# EAGLE design 328p_DIP_Galv_009_gnd (EAGLE 7.1.0)
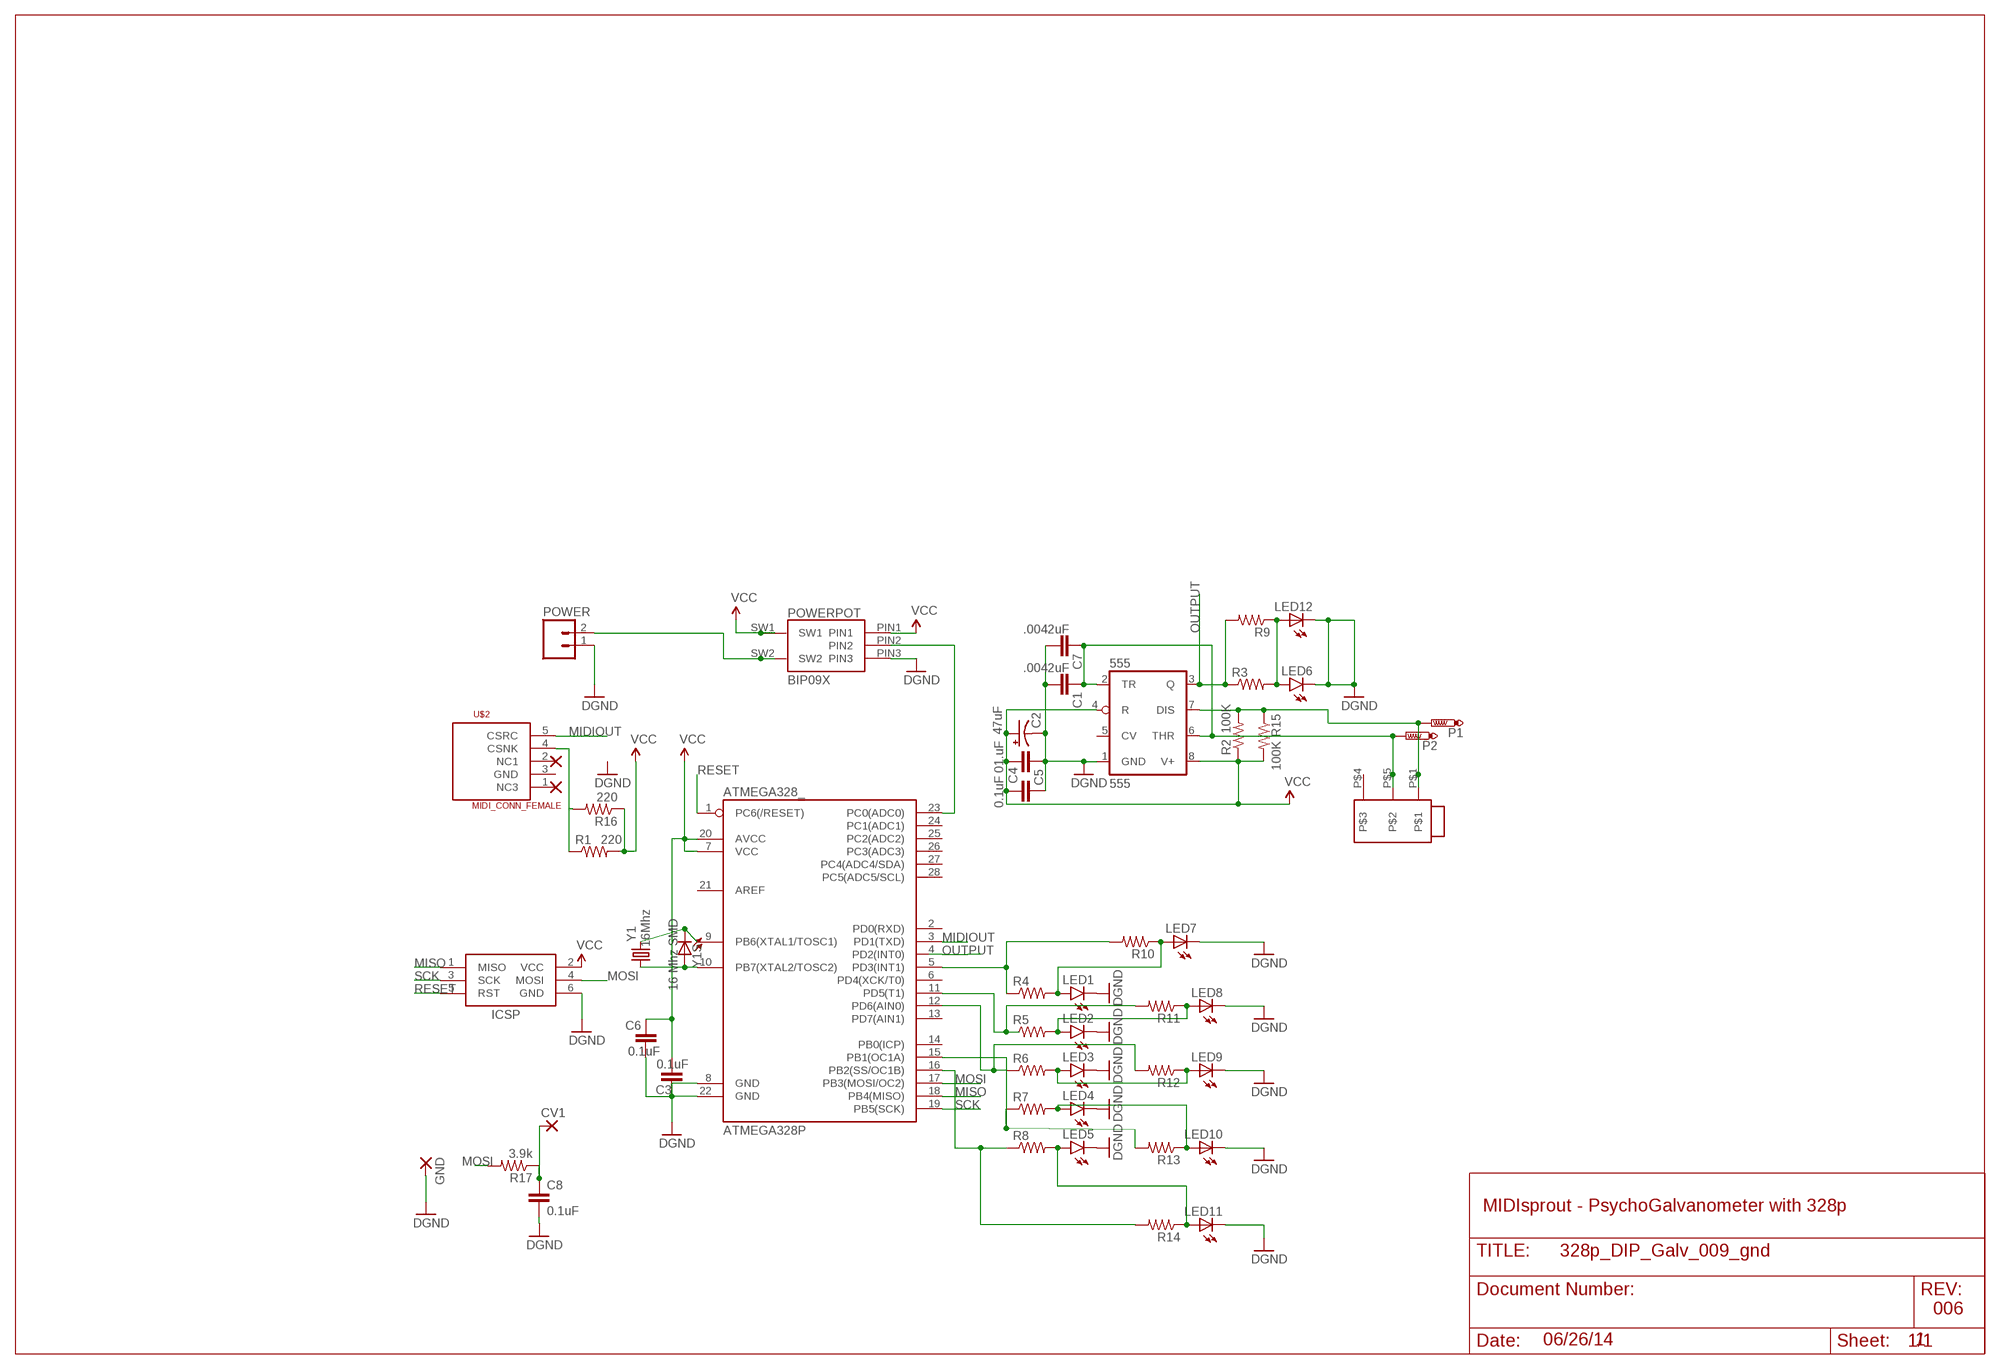
[diagram p0: schematic, sheet 1]

## Parts
555  555  LM555N  [DIL08-ROUND]
ATMEGA328_  ATMEGA328P  ATMEGA328P_PDIP  [DIL28-3]
C1  .0042uF  CAPPTH  [CAP-PTH-SMALL]
C2  47uF  CAP_POLPTH2  [CPOL-RADIAL-10UF-25V]
C3  0.1uF  CAPPTH  [CAP-PTH-SMALL]
C4  0.1uF  CAPPTH  [CAP-PTH-SMALL]
C5  01.uF  CAP1206  [1206]
C6  0.1uF  CAP1206  [1206]
C7  .0042uF  CAP1206  [1206]
C8  0.1uF  CAP1206  [1206]
CV1  2,54/1,1  [2,54/1,1]
GND  2,54/1,1  [2,54/1,1]
ICSP  AVRISP-6  [AVRISP]
LED1  LED5MM  [LED5MM]
LED2  LED5MM  [LED5MM]
LED3  LED5MM  [LED5MM]
LED4  LED5MM  [LED5MM]
LED5  LED5MM  [LED5MM]
LED6  LED5MM  [LED5MM]
LED7  LEDSML1206  [SML1206]
LED8  LEDSML1206  [SML1206]
LED9  LEDSML1206  [SML1206]
LED10  LEDSML1206  [SML1206]
LED11  LEDSML1206  [SML1206]
LED12  LEDSML1206  [SML1206]
P1  PTR1PAD1-20Y  [P1-20Y]
P2  PTR1PAD1-20Y  [P1-20Y]
POWER  M02LOCK_LONGPADS  [1X02_LOCK_LONGPADS]
POWERPOT  BIP09X  [BIP09X]
R1  220  RESISTORAXIAL-0.3  [AXIAL-0.3]
R2  100K  RESISTORAXIAL-0.3  [AXIAL-0.3]
R3  RESISTORAXIAL-0.3  [AXIAL-0.3]
R4  RESISTORAXIAL-0.3  [AXIAL-0.3]
R5  RESISTORAXIAL-0.3  [AXIAL-0.3]
R6  RESISTORAXIAL-0.3  [AXIAL-0.3]
R7  RESISTORAXIAL-0.3  [AXIAL-0.3]
R8  RESISTORAXIAL-0.3  [AXIAL-0.3]
R9  R-US_R1206  [R1206]
R10  R-US_R1206  [R1206]
R11  R-US_R1206  [R1206]
R12  R-US_R1206  [R1206]
R13  R-US_R1206  [R1206]
R14  R-US_R1206  [R1206]
R15  100K  R-US_R1206  [R1206]
R16  220  R-US_R1206  [R1206]
R17  3.9k  R-US_R1206  [R1206]
U$1  MONOJACK  [MONOJACK_SWCR_3.5]
U$2  MIDI_CONN_FEMALE  [DIN_5_FEMALE]
Y1  16Mhz  CRYSTALHC49US  [HC49US]
Y1S  16 Mhz SMD  LEDSML1206  [SML1206]

## Nets
GND: 555.1(GND) ATMEGA328_.8(GND) ATMEGA328_.22(GND) C1.2 C2.2(-) C3.1 C4.2 C5.1 C6.2 C7.2 C8.2 GND.1(P) ICSP.6(GND) LED1.K(C) LED2.K(C) LED3.K(C) LED4.K(C) LED5.K(C) LED6.K(C) LED7.C LED8.C LED9.C LED10.C LED11.C LED12.C POWER.1 POWERPOT.PIN3 ; supply symbol labelled DGND
MIDIOUT: ATMEGA328_.3(PD1(TXD)) U$2.5(CSRC)
MISO: ATMEGA328_.18(PB4(MISO)) ICSP.1(MISO)
MOSI: ATMEGA328_.17(PB3(MOSI/OC2)) ICSP.4(MOSI) R17.2
N$1: C8.1 CV1.1(P) R17.1
N$2: ATMEGA328_.10(PB7(XTAL2/TOSC2)) Y1.1 Y1S.A
N$3: ATMEGA328_.9(PB6(XTAL1/TOSC1)) Y1.2 Y1S.C
N$7: ATMEGA328_.23(PC0(ADC0)) POWERPOT.PIN2
N$9: R1.P$1 R16.2 U$2.4(CSNK)
N$10: ATMEGA328_.5(PD3(INT1)) R4.P$1 R10.2
N$11: ATMEGA328_.11(PD5(T1)) R5.P$1 R11.2
N$12: ATMEGA328_.12(PD6(AIN0)) R6.P$1 R12.2
N$13: POWER.2 POWERPOT.SW2
N$14: ATMEGA328_.15(PB1(OC1A)) R7.P$1 R13.2
N$15: ATMEGA328_.16(PB2(SS/OC1B)) R8.P$1 R14.2
N$16: LED1.A LED7.A R4.P$2 R10.1
N$18: LED2.A LED8.A R5.P$2 R11.1
N$19: LED3.A LED9.A R6.P$2 R12.1
N$20: LED4.A LED10.A R7.P$2 R13.1
N$21: LED5.A LED11.A R8.P$2 R14.1
N$26: LED6.A LED12.A R3.P$2 R9.1
OUTPUT: 555.3(Q) ATMEGA328_.4(PD2(INT0)) R3.P$1 R9.2
PROBE1: 555.2(TR) 555.6(THR) C1.1 C7.1 P2.TP U$1.P$5
PROBE2: 555.7(DIS) P1.TP R2.P$2 R15.1 U$1.P$1
RESET: ATMEGA328_.1(PC6(/RESET)) ICSP.5(RST)
SCK: ATMEGA328_.19(PB5(SCK)) ICSP.3(SCK)
VCC: 555.4(R) 555.8(V+) ATMEGA328_.7(VCC) ATMEGA328_.20(AVCC) C2.1(+) C3.2 C4.1 C5.2 C6.1 ICSP.2(VCC) POWERPOT.PIN1 POWERPOT.SW1 R1.P$2 R2.P$1 R15.2 R16.1
Unconnected: 555.5(CV) ATMEGA328_.2(PD0(RXD)) ATMEGA328_.6(PD4(XCK/T0)) ATMEGA328_.13(PD7(AIN1)) ATMEGA328_.14(PB0(ICP)) ATMEGA328_.21(AREF) ATMEGA328_.24(PC1(ADC1)) ATMEGA328_.25(PC2(ADC2)) ATMEGA328_.26(PC3(ADC3)) ATMEGA328_.27(PC4(ADC4/SDA)) ATMEGA328_.28(PC5(ADC5/SCL)) U$1.P$4 U$2.1(NC3) U$2.2(NC1) U$2.3(GND)

## Notes on the sheet
- MIDIsprout - PsychoGalvanometer with 328p
- 006
- 06/26/14 | 1

## Library data of the parts
555 = adafruit:*555: TIMER Changed DIP package to have round (not oval) pin pads http://www.ladyada.net/library/pcb/eaglelibrary.html
ATMEGA328_ = SparkFun-DigitalIC:ATMEGA328P_PDIP: uC used in the Arduino 32kb flash, 1k EEPROM, 2k SRAM This is the through-hole version of this chip.
C1 C5-C8 = SparkFun-Passives:CAP: Capacitor Standard 0603 ceramic capacitor, and 0.1" leaded capacitor.
C2 = SparkFun-Passives:CAP_POL: Capacitor Polarized These are standard SMD and PTH capacitors. Normally 10uF, 47uF, and 100uF in electrolytic and tantalum varieties. Always verify the external diameter of the through hole cap, it varies with capacity, voltage, and manufacturer. The EIA devices should be standard.
C3 C4 = SparkFun-Capacitors:CAP: Capacitor Standard 0603 ceramic capacitor, and 0.1" leaded capacitor.
CV1 GND = wirepad:2,54/1,1: THROUGH-HOLE PAD
ICSP = adafruit:AVRISP: AVR ISP HEADER Standard 6 pin header for AVR programming
LED1-LED6 = SparkFun-LED:LED: LEDs Standard schematic elements and footprints for 5mm, 3mm, 1206, and 0603 sized LEDs. 5mm - Spark Fun Electronics SKU : COM-00529 (and others)
LED7-LED12 Y1S = led:LED: LED OSRAM: - CHIPLED LG R971, LG N971, LY N971, LG Q971, LY Q971, LO R971, LY R971 LH N974, LH R974 LS Q976, LO Q976, LY Q976 LO Q996 - Hyper CHIPLED LW Q18S LB Q993, LB Q99A, LB R99A - SideLED LS A670, LO A670, LY A670, LG A670, LP A670 LB A673, LV A673, LT A673, LW A673 LH A674 LY A675 LS A676, LA A676, LO A676, LY A676, LW A676 LS A679, LY A679, LG A679 - Hyper Micro SIDELED® LS Y876, LA Y876, LO Y876, LY Y876 LT Y87S - SmartLED LW L88C, LW L88S LB L89C, LB L89S, LG L890 LS L89K, LO L89K, LY L89K LS L896, LA L896, LO L896, LY L896 - TOPLED LS T670, LO T670, LY T670, LG T670, LP T670 LSG T670, LSP T670, LSY T670, LOP T670, LYG T670 LG T671, LOG T671, LSG T671 LB T673, LV T673, LT T673, LW T673 LH T674 LS T676, LA T676, LO T676, LY T676, LB T676, LH T676, LSB T676, LW T676 LB T67C, LV T67C, LT T67C, LS T67K, LO T67K, LY T67K, LW E67C LS E67B, LA E67B, LO E67B, LY E67B, LB E67C, LV E67C, LT E67C LW T67C LS T679, LY T679, LG T679 LS T770, LO T770, LY T770, LG T770, LP T770 LB T773, LV T773, LT T773, LW T773 LH T774 LS E675, LA E675, LY E675, LS T675 LS T776, LA T776, LO T776, LY T776, LB T776 LHGB T686 LT T68C, LB T68C - Hyper Mini TOPLED® LB M676 - Mini TOPLED Santana® LG M470 LS M47K, LO M47K, LY M47K Source: http://www.osram.convergy.de LUXEON: - LUMILED® LXK2-PW12-R00, LXK2-PW12-S00, LXK2-PW14-U00, LXK2-PW14-V00 LXK2-PM12-R00, LXK2-PM12-S00, LXK2-PM14-U00 LXK2-PE12-Q00, LXK2-PE12-R00, LXK2-PE12-S00, LXK2-PE14-T00, LXK2-PE14-U00 LXK2-PB12-K00, LXK2-PB12-L00, LXK2-PB12-M00, LXK2-PB14-N00, LXK2-PB14-P00, LXK2-PB14-Q00 LXK2-PR12-L00, LXK2-PR12-M00, LXK2-PR14-Q00, LXK2-PR14-R00 LXK2-PD12-Q00, LXK2-PD12-R00, LXK2-PD12-S00 LXK2-PH12-R00, LXK2-PH12-S00 LXK2-PL12-P00, LXK2-PL12-Q00, LXK2-PL12-R00 Source: www.luxeon.com KINGBRIGHT: KA-3528ASYC Source: www.kingbright.com
P1 P2 = testpad:PTR1: TEST PIN
POWER = SparkFun-Connectors:M02: Standard 2-pin 0.1" header. Use with - straight break away headers ( PRT-00116) - right angle break away headers (PRT-00553) - swiss pins (PRT-00743) - machine pins (PRT-00117) - female headers (PRT-00115) Molex polarized connector foot print use with: PRT-08233 with associated crimp pins and housings. 2.54_SCREWTERM for use with PRT-10571. 3.5mm Screw Terminal footprints for PRT-08084 5mm Screw Terminal footprints for use with PRT-08433
POWERPOT = MIDIsprout:BIP09X
R1-R8 = SparkFun-Passives:RESISTOR: Resistor Basic schematic elements and footprints for 0603, 1206, and PTH resistors.
R9-R17 = resistor:R-US_: RESISTOR, American symbol
U$1 = MONOJack_2:MONOJACK
U$2 = SparkFun-Connectors:MIDI_CONN_FEMALE: MIDI connector, no strain relieve (DIN-5 female)
Y1 = SparkFun-FreqCtrl:CRYSTAL: Various standard crystals. Proven footprints. Spark Fun Electronics SKU : COM-00534

## Board
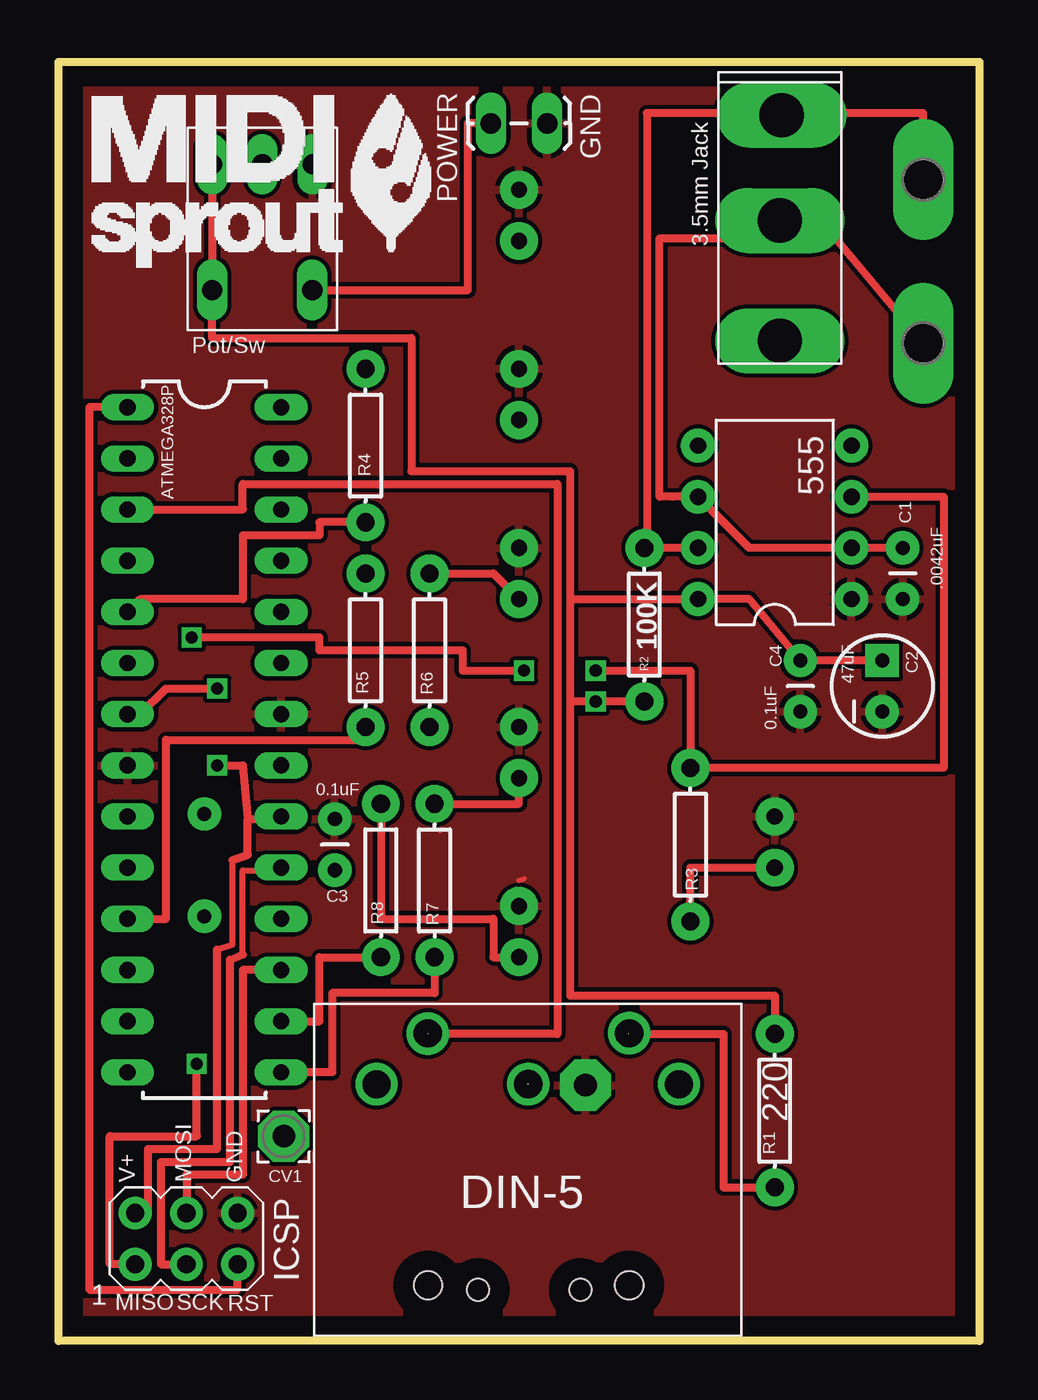
[diagram p1: board, top side]
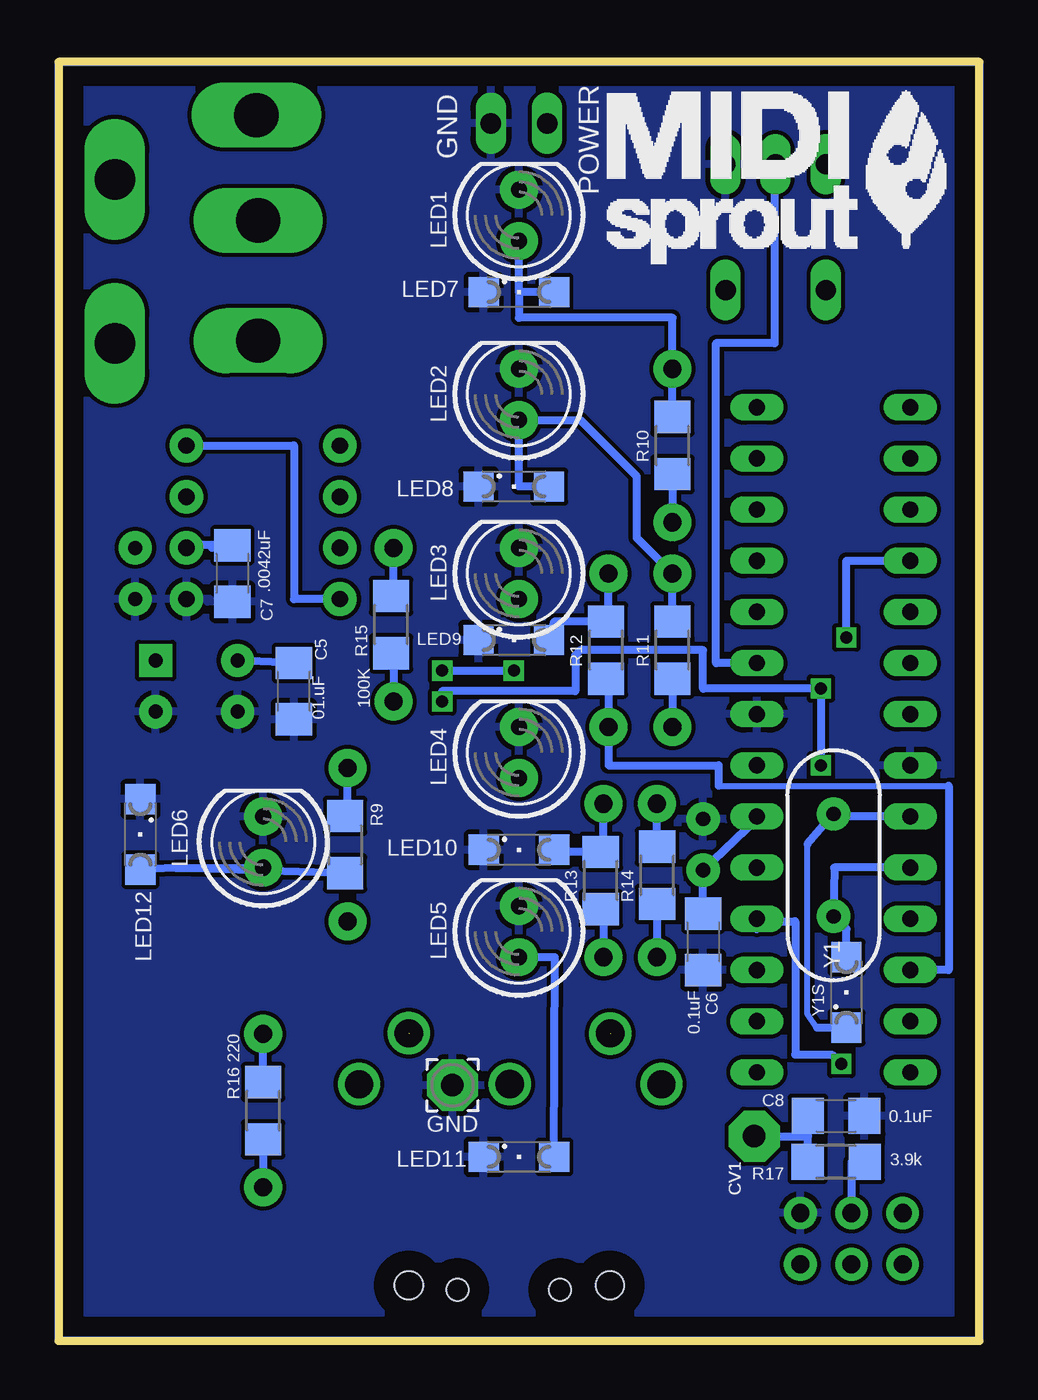
[diagram p2: board, bottom side, seen from below]

Size 45.72 x 63.5 mm. Coordinates in mm from the lower left corner, seen from the top.
Outline: 0,0 0,63.5 45.72,63.5 45.72,0 0,0
Copper layers (1*16): Top 0.035mm / dielectric 1.5mm / Bottom 0.035mm
Design rules "default": minimum track width 10mil, minimum drill 24mil, track to track 8mil, track to pad 8mil, pad to pad 8mil, via to via 8mil, smd to smd 8mil, copper to edge 40mil, drill to drill 8mil, minimum pad ring 10mil, minimum via ring 8mil, stop-mask expansion 4mil, vias tented up to drill 0mil, thermal gap 10mil
Holes 1.1 mm at 20.83,2.54 25.91,2.54

### Footprints (pad centres in the part's own frame; a part is rotated, then mirrored left to right if it is on the bottom)
DIL08-ROUND = drill 0.813 pad 1.676: 1 -3.81,-3.81; 2 -1.27,-3.81; 3 1.27,-3.81; 4 3.81,-3.81; 5 3.81,3.81; 6 1.27,3.81; 7 -1.27,3.81; 8 -3.81,3.81
DIL28-3 = drill 0.813 long: 1 -16.51,-3.81; 2 -13.97,-3.81; 3 -11.43,-3.81; 4 -8.89,-3.81; 5 -6.35,-3.81; 6 -3.81,-3.81; 7 -1.27,-3.81; 8 1.27,-3.81; 9 3.81,-3.81; 10 6.35,-3.81; 11 8.89,-3.81; 12 11.43,-3.81; 13 13.97,-3.81; 14 16.51,-3.81; 15 16.51,3.81; 16 13.97,3.81; 17 11.43,3.81; 18 8.89,3.81; 19 6.35,3.81; 20 3.81,3.81; 21 1.27,3.81; 22 -1.27,3.81; 23 -3.81,3.81; 24 -6.35,3.81; 25 -8.89,3.81; 26 -11.43,3.81; 27 -13.97,3.81; 28 -16.51,3.81
CAP-PTH-SMALL = drill 0.7 pad 1.651: 1 0,0; 2 2.54,0
CPOL-RADIAL-10UF-25V = drill 0.7 pad 1.651 square: 1 1.27,0 | drill 0.7 pad 1.651: 2 -1.27,0
1206 = smd 1.6 x 1.8: 1 -1.4,0; 2 1.4,0
2,54/1,1 = drill 1.118 pad 2.54 octagon: 1 0,0
AVRISP = drill 0.9 pad 1.626: 1 -1.27,2.54; 2 1.27,2.54; 3 -1.27,0; 4 1.27,0; 5 -1.27,-2.54; 6 1.27,-2.54
LED5MM = drill 0.813 pad 1.88: A -1.27,0; K 1.27,0
SML1206 = smd 1.5 x 1.5: A 1.75,0; C -1.75,0
P1-20Y = drill 2.007 pad 2.54 long: TP 0,0
1X02_LOCK_LONGPADS = drill 1.016 long: 1 -0.127,0; 2 2.667,0
BIP09X = drill 1 long: PIN1 0,0; PIN2 2.5,0; PIN3 5,0; SW1 0,-6.25; SW2 4.98,-6.25
AXIAL-0.3 = drill 0.9 pad 1.88: P$1 -3.81,0; P$2 3.81,0
R1206 = smd 1.6 x 1.803: 1 -1.422,0; 2 1.422,0
MONOJACK_SWCR_3.5 = drill 2.2 pad 2.286 long: P$1 -5.227,0.091; P$4 5.969,0; P$5 0,0
DIN_5_FEMALE = drill 1.4: 1 7.94,3.6; 2 0.46,3.61; 3 -7.07,3.6; 4 5.47,6.13; 5 -4.53,6.12 | hole 1.4: -4.52,-6.38; 5.47,-6.38
HC49US = drill 0.7 pad 1.651: 1 -2.54,0; 2 2.54,0

### Placement (x,y rotation side)
555  35.56,40.64 90 top
ATMEGA328_  7.24,29.84 270 top
C1  41.91,39.37 270 top
C2  40.89,32.51 90 top
C3  13.72,25.91 270 top
C4  36.83,33.78 270 top
C5  34.04,32.26 90 bottom
C6  13.72,19.81 270 bottom
C7  37.08,38.1 270 bottom
C8  7.11,11.18 0 bottom
CV1  11.18,10.16 270 top
GND  26.16,12.7 180 bottom
ICSP  6.35,5.08 90 top
LED1  22.86,55.88 90 bottom
LED2  22.86,46.99 90 bottom
LED3  22.86,38.1 90 bottom
LED4  22.86,29.21 90 bottom
LED5  22.86,20.32 90 bottom
LED6  35.56,24.77 90 bottom
LED7  22.86,52.07 0 bottom
LED8  23.11,42.42 0 bottom
LED9  23.11,34.8 0 bottom
LED10  22.86,24.38 0 bottom
LED11  22.86,9.14 0 bottom
LED12  41.66,25.15 270 bottom
P1  42.93,57.66 0 top
P2  42.93,49.53 0 top
POWER  24.13,60.45 180 top
POWERPOT  7.62,58.42 0 top
R1  35.56,11.43 90 top
R2  29.08,35.56 90 top
R3  31.37,24.64 270 top
R4  15.24,44.45 90 top
R5  15.24,34.29 90 top
R6  18.41,34.29 90 top
R7  18.67,22.86 90 top
R8  16,22.86 90 top
R9  31.5,24.64 90 bottom
R10  15.24,44.45 270 bottom
R11  15.24,34.29 270 bottom
R12  18.54,34.29 270 bottom
R13  18.8,22.86 270 bottom
R14  16,23.11 270 bottom
R15  29.21,35.56 270 bottom
R16  35.56,11.43 270 bottom
R17  7.11,8.89 0 bottom
U$1  35.81,55.63 270 top
U$2  22.86,9.14 0 top
Y1  7.24,23.62 90 bottom
Y1S  6.6,17.3 90 bottom

### Tracks (layer width: path | path; a pad name or v marks a point on that pad's centre or on a via)
GND
  pour Bottom: 0,0 0,63.5 45.72,63.5 45.72,62.23 45.72,0
  pour Top: 0,0 0,63.5 45.72,63.5 45.72,0
GND1
  Top 0.254: 19.05,25.4 18.94,25.32 | 22.86,22.86 23.13,22.94
  pour Top: 0,0 0,63.5 45.72,63.5 45.72,0
MIDIOUT  (1 unrouted)
  Top 0.406: ATMEGA328_.3 9.14,41.27 9.14,42.55 24.77,42.55 24.77,15.24 18.33,15.24
MISO  (via drill 0.6)
  Top 0.406: ICSP.1 2.54,3.81 2.54,10.16 6.86,10.16 v6.86,13.75
  Bottom 0.406: ATMEGA328_.18 11.05,20.45 10.67,20.83 9.14,20.83 9.14,14.22 7.33,14.22 v6.86,13.75 6.96,13.82
MOSI
  Top 0.406: ATMEGA328_.17 9.14,18.41 9.14,8.26 6.35,8.26 ICSP.4
  Bottom 0.406: R17.2 6.35,8.89 ICSP.4
N$1
  Bottom 0.406: CV1.1 8.51,10.16 C8.1 8.53,11.18 R17.1
N$2
  Bottom 0.406: ATMEGA328_.10 7.21,23.5 Y1.1 | 6.86,20.7 Y1.1 | Y1S.A 6.6,20.44 Y1.1
N$3
  Bottom 0.305: 8.54,24.66 8.54,16.23 8.06,15.55
  Bottom 0.406: ATMEGA328_.9 7.11,26.04 Y1.2 8.54,24.66 | Y1S.C 8.06,15.55
N$7
  Bottom 0.406: ATMEGA328_.23 13.08,33.66 13.08,49.53 10.16,49.53 10.16,59.44 POWERPOT.PIN2
N$8
  Top 0.406: 0,0 0,63.5 45.72,63.5 45.72,0 0,0
N$9  (1 unrouted)
  Top 0.406: 28.3,15.24 33.02,15.24 33.02,7.62 R1.P$1
  Bottom 0.406: R16.2 R1.P$1
N$10
  Top 0.406: R4.P$1 12.95,40.64 12.95,40.01 9.14,40.01 9.14,36.83 4.06,36.83 ATMEGA328_.5
  Bottom 0.406: R10.2 R4.P$1
N$11
  Top 0.406: ATMEGA328_.11 5.33,20.95 5.33,29.84 15.24,29.84 R5.P$1
  Bottom 0.406: R11.2 R5.P$1
N$12
  Bottom 0.305: 12.95,27.56 1.52,27.56
  Bottom 0.406: 12.95,27.56 12.95,28.57 18.41,28.57 R6.P$1 18.41,32.87 R12.2 | 1.52,27.56 1.52,18.41 ATMEGA328_.12
N$13
  Top 0.406: POWER.2 20.32,60.45 20.32,52.17 POWERPOT.SW2
N$14
  Top 0.406: R7.P$1 18.67,17.27 13.59,17.27 13.59,13.34 ATMEGA328_.15
  Bottom 0.406: R13.2 18.67,21.44 R7.P$1
N$15
  Top 0.406: ATMEGA328_.16 12.95,15.88 12.95,19.05 R8.P$1
  Bottom 0.406: R14.2 R8.P$1
N$16
  Bottom 0.406: 22.86,52.07 LED1.A | LED7.A 22.86,52.07 | 22.86,52.07 22.86,50.8 15.24,50.8 R4.P$2 R10.1
N$17
  Bottom 0.406: 45.72,63.5 0,63.5 0,0 45.72,0 45.72,63.5
N$18
  Bottom 0.406: R11.1 R5.P$2 17.02,39.88 17.02,42.93 19.81,45.72 LED2.A 22.86,42.42 LED8.A
N$19
  Top 0.406: R6.P$2 21.59,38.1 LED3.A
  Bottom 0.406: R6.P$2 18.41,35.71 R12.1 21.11,35.71 LED9.A
N$20
  Top 0.406: R7.P$2 22.86,26.67 LED4.A
  Bottom 0.406: R7.P$2 18.67,24.28 R13.1 21.11,24.28 LED10.A
N$21
  Top 0.406: R8.P$2 16,20.95 21.59,20.95 21.59,19.05 LED5.A
  Bottom 0.406: R14.1 R8.P$2 | LED11.A 21.08,19.05 LED5.A
N$26
  Top 0.406: R3.P$2 31.37,23.5 LED6.A
  Bottom 0.406: R9.1 39.88,23.47 | 39.88,23.47 LED12.A | 39.88,23.47 35.56,23.47 LED6.A
OUTPUT  (via drill 0.6)
  Top 0.406: 555.3 43.94,41.91 43.94,28.45 R3.P$1 31.37,33.27 v26.67,33.27 | v6.6,34.92 12.95,34.92 12.95,34.29 20.07,34.29 20.07,33.27 v23.11,33.27
  Bottom 0.406: v26.67,33.27 v23.11,33.27 | v6.6,34.92 6.6,38.73 ATMEGA328_.4 | R9.2 31.37,26.06 R3.P$1
PROBE1
  Top 0.406: C1.1 555.2 34.29,39.37 555.6 | 555.6 30.48,41.91 | 555.6 29.84,41.91 29.84,54.74 35.81,54.74 35.81,54.86 | P2.TP 38.48,54.86 35.81,54.86 | 35.81,54.86 U$1.P$5
  Bottom 0.406: C7.1 38.1,39.5 | 38.1,39.5 38.1,39.37 | 38.1,39.5 39.37,39.5 555.2
PROBE2
  Top 0.406: 555.7 29.21,39.37 | 29.21,39.37 R2.P$2 | 29.21,39.37 29.21,60.96 35.56,60.96 | P1.TP 42.93,60.96 35.56,60.96 | U$1.P$1 35.56,61.11 35.56,60.96
  Bottom 0.406: R15.1 29.08,36.98 R2.P$2
RESET
  Top 0.406: ATMEGA328_.1 1.52,46.35 1.52,2.54 8.89,2.54 ICSP.5
SCK
  Top 0.305: 9.14,19.18 9.14,23.37 11.05,23.37
  Top 0.406: ICSP.3 5.08,3.81 5.08,8.89 8.51,8.89 8.51,18.92 9.14,19.18 | 11.05,23.37 ATMEGA328_.19
VCC  (via drill 0.6)
  Top 0.305: 7.87,19.43 8.64,19.68 8.64,23.88
  Top 0.406: ICSP.2 4.45,6.35 4.45,9.53 7.87,9.53 7.87,19.43 | 25.4,36.83 25.4,43.18 17.53,43.18 17.53,49.78 7.62,49.78 POWERPOT.SW1 POWERPOT.PIN1 | 25.4,36.83 555.8 34.29,36.83 C4.1 C2.1 | 25.4,36.83 25.4,31.75 | 25.4,31.75 25.4,17.14 35.56,17.14 R1.P$2 | R2.P$1 v26.67,31.75 25.4,31.75 | ATMEGA328_.7 4.06,31.11 5.33,32.38 v7.87,32.38 | 8.64,23.88 9.4,24.13 9.4,25.91 | 9.4,25.91 11.05,25.91 ATMEGA328_.20 | v7.87,28.57 9.14,28.57 9.4,25.91
  Bottom 0.406: v7.87,28.57 v7.87,32.38 13.72,32.38 13.72,34.29 19.81,34.29 20.07,34.04 20.07,32.26 26.67,32.26 v26.67,31.75 | 555.4 34.04,44.45 34.04,36.83 555.8 | ATMEGA328_.20 11.05,25.91 C3.2 C6.1 | C5.2 C4.1 | R15.2 29.08,34.14 R2.P$1 | R16.1 R1.P$2

### Text on the board
tPlace: GND
bPlace: GND | POWER | R16 220
tNames: 3.5mm Jack | Pot/Sw | V+ | MOSI | GND | MISO | SCK | RST
bNames: LED7 | R10 | LED8 | R15 | R11 | R12 | LED9 | R9 | LED10 | R14 | R13 | LED12 | CV1 | CV1 | LED11
tStop: 328p_DIP_Galv_009 | rev 01 (2016)
bStop: 328p_DIP_Galv_009 | Ground Lift | rev 01 (2016)